# EAGLE design 2te8x24V_DC_In_4_v03 (EAGLE 9.6.2)
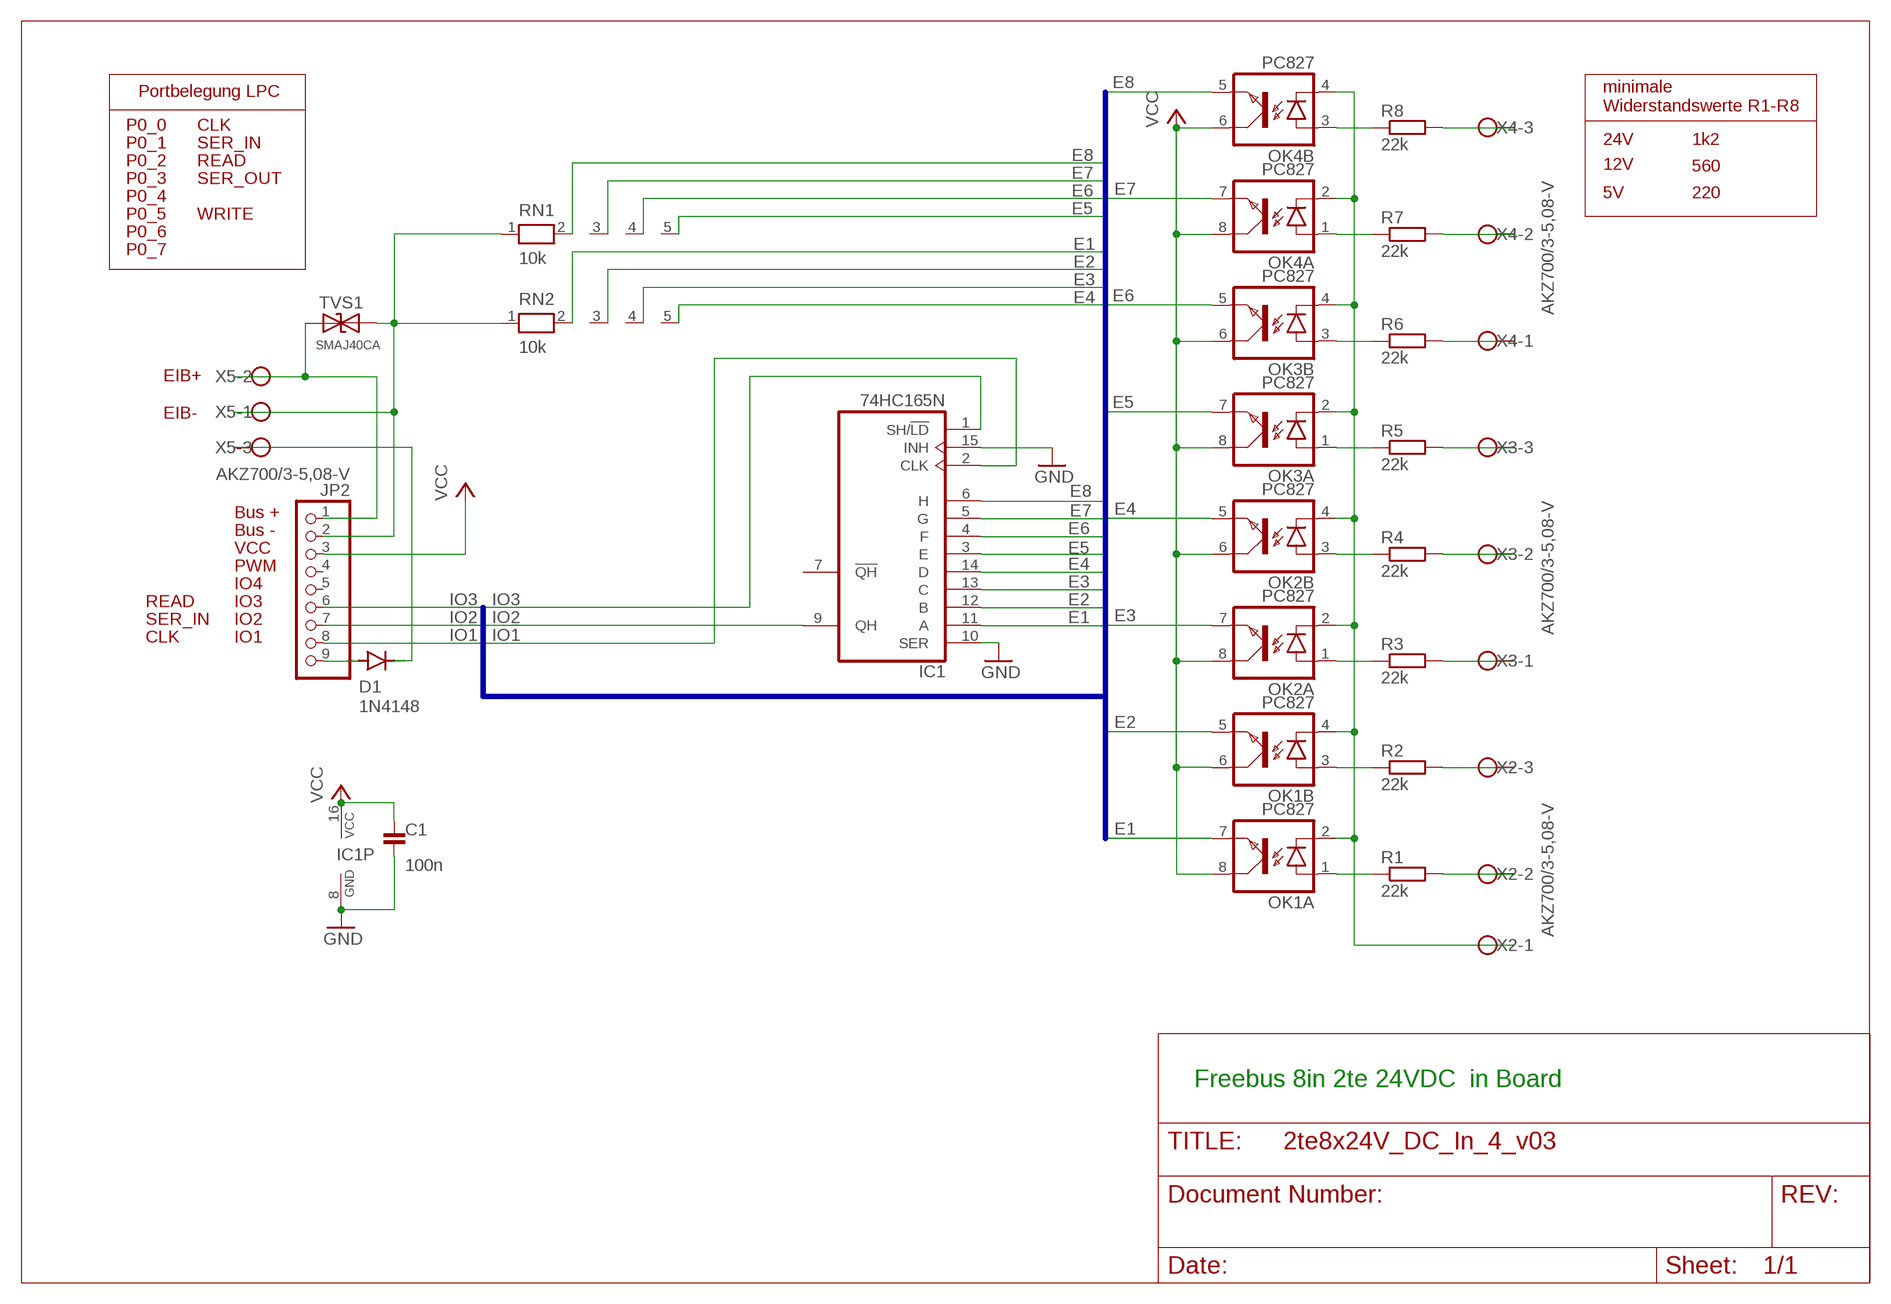
[diagram p0: schematic, sheet 1]

## Parts
C1  100n  C-EU025-024X044  [C025-024X044]
D1  1N4148  1N4148DO35-7  [DO35-7]
IC1  74HC165N  [DIL16]
JP2  PINHD-1X9  [1X09]
OK1  PC827  [DIL08]
OK2  PC827  [DIL08]
OK3  PC827  [DIL08]
OK4  PC827  [DIL08]
R1  22k  R-EU_0207/10  [0207/10]
R2  22k  R-EU_0207/10  [0207/10]
R3  22k  R-EU_0207/10  [0207/10]
R4  22k  R-EU_0207/10  [0207/10]
R5  22k  R-EU_0207/10  [0207/10]
R6  22k  R-EU_0207/10  [0207/10]
R7  22k  R-EU_0207/10  [0207/10]
R8  22k  R-EU_0207/10  [0207/10]
RN1  10k  RN04  [RN-5]
RN2  10k  RN04  [RN-5]
TVS1  SMAJ40CA  [DO-214AC(SMA)_BI]
X2  AKZ700/3-5,08-V  [AKZ700/3-5,08-V]
X3  AKZ700/3-5,08-V  [AKZ700/3-5,08-V]
X4  AKZ700/3-5,08-V  [AKZ700/3-5,08-V]
X5  AKZ700/3-5,08-V  [AKZ700/3-5,08-V]

## Nets
E1: IC1.11(A) OK1.7(A:EMIT) RN2.2
E2: IC1.12(B) OK1.5(B:EMIT) RN2.3
E3: IC1.13(C) OK2.7(A:EMIT) RN2.4
E4: IC1.14(D) OK2.5(B:EMIT) RN2.5
E5: IC1.3(E) OK3.7(A:EMIT) RN1.5
E6: IC1.4(F) OK3.5(B:EMIT) RN1.4
E7: IC1.5(G) OK4.7(A:EMIT) RN1.3
E8: IC1.6(H) OK4.5(B:EMIT) RN1.2
EIB+: JP2.1 TVS1.2(A2) X5.2
GND: C1.2 IC1.8(GND) IC1.10(SER) IC1.15(INH) JP2.2 RN1.1 RN2.1 TVS1.1(A1) X5.1
GND24: OK1.2(A:C) OK1.4(B:C) OK2.2(A:C) OK2.4(B:C) OK3.2(A:C) OK3.4(B:C) OK4.2(A:C) OK4.4(B:C) X2.1
IO1: IC1.2(CLK) JP2.8
IO2: IC1.9(QH) JP2.7
IO3: IC1.1(SH/!LD) JP2.6
N$1: D1.C X5.3
N$2: OK1.1(A:A) R1.1
N$3: R1.2 X2.2
N$4: OK1.3(B:A) R2.1
N$5: R2.2 X2.3
N$6: OK2.1(A:A) R3.1
N$7: R3.2 X3.1
N$8: OK2.3(B:A) R4.1
N$9: R4.2 X3.2
N$10: OK3.1(A:A) R5.1
N$11: R5.2 X3.3
N$12: OK3.3(B:A) R6.1
N$13: R6.2 X4.1
N$14: OK4.1(A:A) R7.1
N$15: R7.2 X4.2
N$16: OK4.3(B:A) R8.1
N$17: R8.2 X4.3
N$18: D1.A JP2.9
VCC: C1.1 IC1.16(VCC) JP2.3 OK1.6(B:COL) OK1.8(A:COL) OK2.6(B:COL) OK2.8(A:COL) OK3.6(B:COL) OK3.8(A:COL) OK4.6(B:COL) OK4.8(A:COL)
Unconnected: IC1.7(!QH) JP2.4 JP2.5

## Buses
IO[1..8],E[1..8]

## Notes on the sheet
- Portbelegung LPC
- minimale
  Widerstandswerte R1-R8
- P0_0 | CLK
- P0_1 | SER_IN | 24V | 1k2
- P0_2 | READ | 12V
- 560
- P0_3 | SER_OUT
- P0_4 | 5V | 220
- P0_5 | WRITE
- P0_6
- P0_7
- EIB+
- EIB-
- Bus +
- Bus -
- VCC
- PWM
- IO4
- READ | IO3
- SER_IN | IO2
- CLK | IO1
- Freebus 8in 2te 24VDC  in Board

## Library data of the parts
C1 = MyRCL:C-EU: CAPACITOR, European symbol; SPICEPREFIX: C
D1 = diode:1N4148: DIODE high speed (Philips)
IC1 = 74xx-eu:74*165: 8-bit parallel load SHIFT REGISTER
JP2 = pinhead:PINHD-1X9: PIN HEADER
OK1-OK4 = optocoupler:PC827: SHARP OPTO COUPLER; OC_FARNELL: unknown; OC_NEWARK: unknown
R1-R8 = MyResistor:R-EU_: RESISTOR, European symbol
RN1 RN2 = resistor-net:RN04: RESISTOR NETWORK; OC_FARNELL: unknown; OC_NEWARK: unknown
TVS1 = MyDiode:SMAJ*CA: Transient Voltage Suppressor Diode https://www.vishay.com/docs/88390/smaj50a.pdf; MARKING: YR; WURTH_ELEKTRONICS: 824501401
X2-X5 = MyCon-PTR-AKZ700:AKZ700/3-5,08-V: PTR AKZ700/3-5,08-V Printklemme Nennstrom: 24 A Nennspannung: 250 V Rastermaß: 5,08 mm Polzahl: 2 Anschlussart: Schraubanschluss Montage: Löten Anschlussrichtung Leiter/Platine: 0 °

## Board
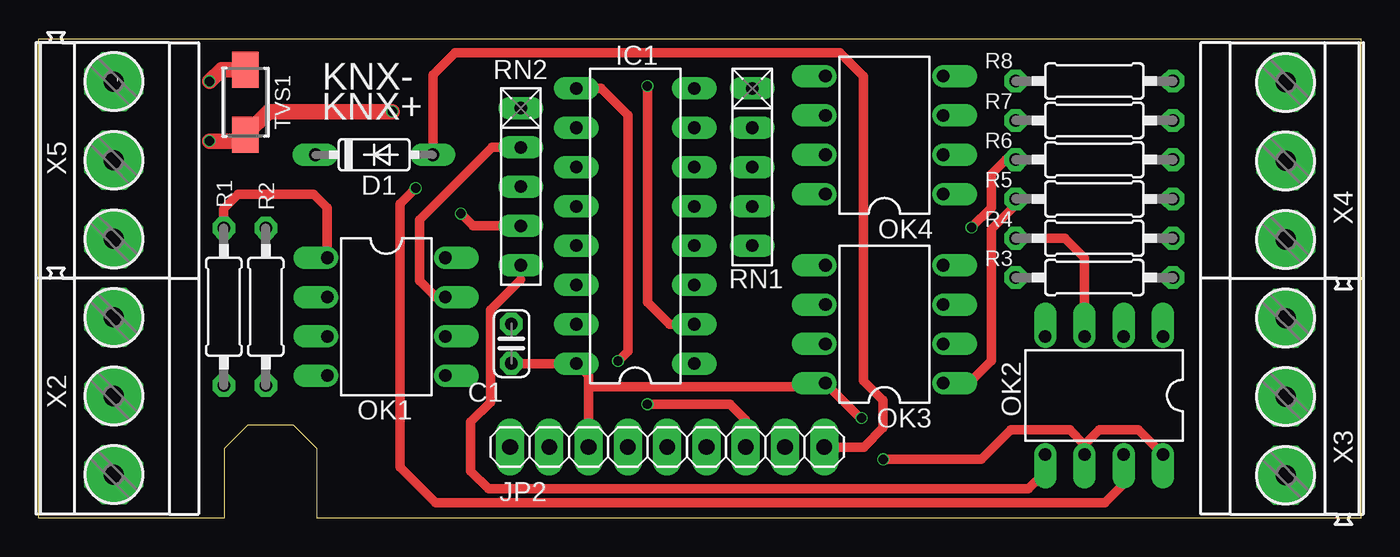
[diagram p1: board, top side]
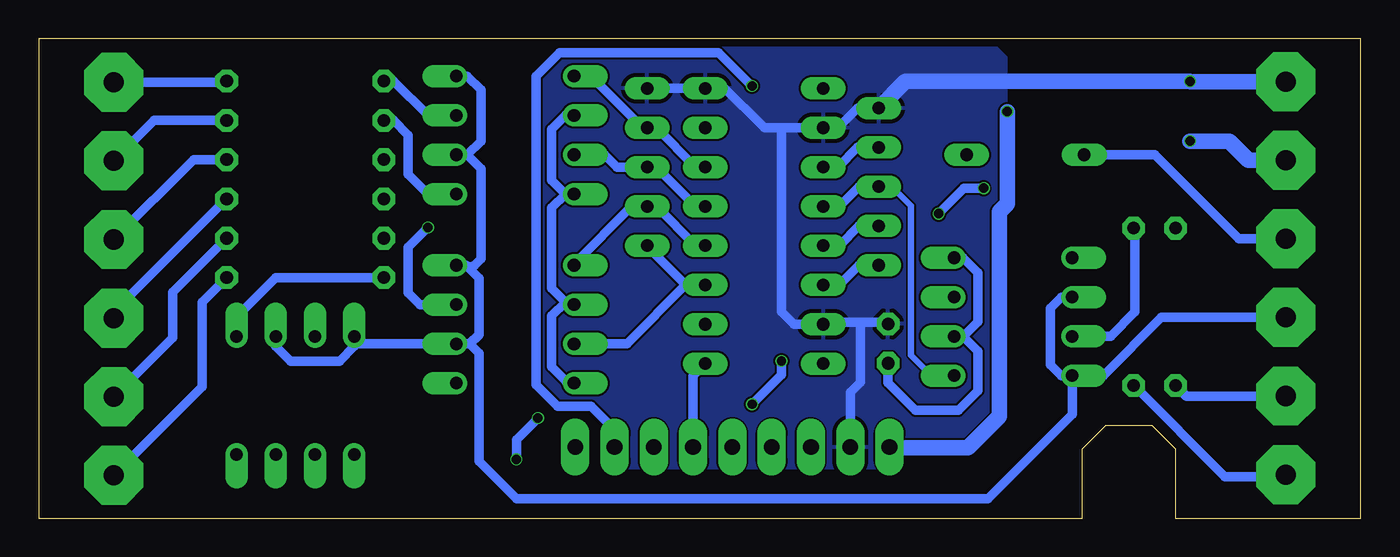
[diagram p2: board, bottom side, seen from below]

Size 85.5 x 31 mm. Coordinates in mm from the lower left corner, seen from the top.
Outline: 0,0 0,31 85.5,31 85.5,0 18,0 18,4.5 16.5,6 13.5,6 12,4.5 12,0 0,0
Copper layers (1*16): Top 0.035mm / dielectric 1.6mm / Bottom 0.035mm
Design rules "jlcpcb-2layers": minimum track width 5mil, minimum drill 0.3mm, track to track 5mil, track to pad 5mil, pad to pad 5mil, via to via 5mil, smd to smd 5mil, copper to edge 0.2mm, drill to drill 6mil, minimum pad ring 10mil, minimum via ring 3mil, stop-mask expansion 4mil, vias tented up to drill 0mil, thermal gap 10mil

### Footprints (pad centres in the part's own frame; a part is rotated, then mirrored left to right if it is on the bottom)
C025-024X044 = drill 0.813 octagon: 1 -1.27,0; 2 1.27,0
DO35-7 = drill 0.813 long: A 3.81,0; C -3.81,0
DIL16 = drill 0.813 long: 1 -8.89,-3.81; 2 -6.35,-3.81; 3 -3.81,-3.81; 4 -1.27,-3.81; 5 1.27,-3.81; 6 3.81,-3.81; 7 6.35,-3.81; 8 8.89,-3.81; 9 8.89,3.81; 10 6.35,3.81; 11 3.81,3.81; 12 1.27,3.81; 13 -1.27,3.81; 14 -3.81,3.81; 15 -6.35,3.81; 16 -8.89,3.81
1X09 = drill 1.016 long: 1 -10.16,0; 2 -7.62,0; 3 -5.08,0; 4 -2.54,0; 5 0,0; 6 2.54,0; 7 5.08,0; 8 7.62,0; 9 10.16,0
DIL08 = drill 0.813 offset: 1 -3.81,-3.81; 2 -1.27,-3.81; 3 1.27,-3.81; 4 3.81,-3.81; 5 3.81,3.81; 6 1.27,3.81; 7 -1.27,3.81; 8 -3.81,3.81
0207/10 = drill 0.813 octagon: 1 -5.08,0; 2 5.08,0
RN-5 = drill 0.813 long: 1 -5.08,0; 2 -2.54,0; 3 0,0; 4 2.54,0; 5 5.08,0
DO-214AC(SMA)_BI = smd 2.3 x 1.7: 1 -2.1,0; 2 2.1,0
AKZ700/3-5,08-V = drill 1.3 pad 3.81 octagon: 1 -7.641,0.025; 2 -2.561,0.025; 3 2.519,0.025

### Placement (x,y rotation side)
C1  30.58,11.29 90 top
D1  21.69,23.5 0 top
IC1  38.58,18.89 90 top
JP2  40.64,4.6 0 top
OK1  22.48,13.03 270 top
OK2  68.9,7.94 180 top
OK3  54.69,12.54 90 top
OK4  54.69,24.76 90 top
R1  11.97,13.67 270 top
R2  14.68,13.67 270 top
R3  68.26,15.56 0 top
R4  68.26,18.1 0 top
R5  68.26,20.64 0 top
R6  68.26,23.18 0 top
R7  68.26,25.72 0 top
R8  68.26,28.26 0 top
RN1  46.15,22.7 270 top
RN2  31.18,21.43 270 top
TVS1  13.37,26.89 270 top
X2  4.83,5.34 270 top
X3  80.66,10.42 90 top
X4  80.66,25.66 90 top
X5  4.83,20.58 270 top

### Tracks (layer width: path | path; a pad name or v marks a point on that pad's centre or on a via)
E1
  Top 0.61: OK1.7 25.7,14.3 24.64,15.37 24.64,19.3 29.3,23.97 RN2.2
  Bottom 0.61: RN2.2 32.54,23.97 33.81,22.7 IC1.11
E2
  Bottom 0.406: RN2.3 30.32,21.43 29.08,20.19 29.08,10.54 27.76,9.22 OK1.5
  Bottom 0.61: IC1.12 33.72,20.16 32.45,21.43 RN2.3
E3  (via drill 0.61)
  Top 0.61: RN2.4 28.1,18.89 v27.3,19.68 | v24.38,21.34 23.37,20.32 23.37,3.3 25.65,1.02 68.96,1.02 70.17,2.22 OK2.7
  Bottom 0.61: IC1.13 33.72,17.62 32.45,18.89 RN2.4 | v27.3,19.68 25.65,21.34 v24.38,21.34
E4
  Top 0.406: RN2.5 31.18,15.43 | 65.09,2.98 OK2.5
  Top 0.61: 31.18,15.43 29.21,13.46 29.21,7.49 27.94,6.22 27.94,3.05 29.08,1.91 64.01,1.91 65.09,2.98
  Bottom 0.61: IC1.14 33.72,15.08 32.45,16.35 RN2.5
E5
  Bottom 0.406: 46.15,17.57 RN1.5
  Bottom 0.61: IC1.3 43.66,15.08 | 43.66,15.08 46.15,17.57 | OK3.7 47.47,11.27 43.66,15.08
E6
  Bottom 0.61: IC1.4 43.02,17.62 45.56,20.16 RN1.4 47.15,20.16 50.88,16.43 OK3.5
E7
  Bottom 0.406: OK4.7
  Bottom 0.61: IC1.5 43.02,20.16 45.56,22.7 RN1.3 48.1,22.7 48.9,23.5 OK4.7
E8
  Bottom 0.406: RN1.2 46.31,25.4 46.61,25.4
  Bottom 0.61: IC1.6 43.02,22.7 45.56,25.24 RN1.2 | 46.61,25.4 49.78,28.57 OK4.5
EIB+  (via drill 0.61)
  Top 1.016: v11.05,24.38 12.96,24.38 TVS1.2 14.87,26.29 v22.86,26.29
  Bottom 0.61: 30.45,4.57 JP2.1
  Bottom 1.016: X5.2 7.27,23.14 8.52,24.38 v11.05,24.38 | v22.86,26.29 22.86,20.32 23.37,19.81 23.37,6.6 25.4,4.57 30.45,4.57
GND  (via drill 0.61)
  Top 1.016: v11.05,28.25 11.84,28.99 TVS1.1
  Bottom 0.406: 11.02,28.22 11.05,28.19 v11.05,28.25 | 34.62,12.68 IC1.15 | 37.31,25.24 37.47,25.08 | 42.23,27.94 IC1.8 | RN1.1
  Bottom 0.61: 32.35,12.68 32.35,8.79 33.02,8.13 JP2.2 | C1.2 30.7,12.68 32.35,12.68 | 34.62,12.68 32.35,12.68 | RN2.1 32.54,26.51 33.81,25.24 IC1.10 37.31,25.24 38.58,25.24 41.27,27.94 42.23,27.94 | IC1.15 36.67,12.54 37.47,13.34 37.47,25.08 | IC1.8 RN1.1
  Bottom 1.016: X5.1 11.02,28.22 | v11.05,28.25 29.45,28.25 RN2.1
  pour Bottom: 22.86,29.84 23.5,30.48 52.7,30.48 53.34,29.84 53.34,3.81 52.7,3.17 26.04,3.17 22.86,6.35
GND24
  Bottom 0.406: 19.38,9.22 OK1.4 | 65.09,11.43 65.09,11.11 | 57.31,16.35 OK3.4
  Bottom 0.61: X2.1 12.89,12.98 16.64,9.22 OK1.4 18.67,6.73 24.13,1.27 54.61,1.27 57.02,3.68 57.02,10.67 57.63,11.27 | 57.63,11.27 OK3.2 64.93,11.27 65.09,11.43 OK2.4 | OK1.2 19.36,14.3 20.07,13.59 20.07,9.91 19.38,9.22 | 65.09,11.11 66.04,10.16 69.22,10.16 70.17,11.11 OK2.2 | OK4.4 57.78,28.57 56.9,27.69 56.9,24.38 57.78,23.5 | OK4.2 57.78,23.5 | 57.78,23.5 56.9,22.61 56.9,16.76 57.31,16.35 | OK3.4 57.86,16.35 57.02,15.51 57.02,11.88 57.63,11.27
IO1  (via drill 0.61)
  Top 0.61: v39.37,27.94 39.37,13.97 40.8,12.54 IC1.2
  Bottom 0.61: JP2.8 48.26,5.71 49.78,7.24 51.94,7.24 53.34,8.64 53.34,28.57 51.82,30.1 41.53,30.1 v39.37,27.94
IO2  (via drill 0.61)
  Top 0.61: JP2.7 45.72,6.35 44.7,7.37 v39.37,7.37 | v37.47,10.16 38.1,10.79 38.1,26.04 36.35,27.78 IC1.9
  Bottom 0.61: v39.37,7.37 37.47,9.27 v37.47,10.16
IO3
  Bottom 0.61: IC1.1 43.18,9.21 JP2.6
N$1
  Bottom 0.61: X5.3 7.9,18.06 13.34,23.5 D1.C
N$2
  Top 0.61: R1.1 11.97,20.02 12.91,20.95 17.78,20.95 18.67,20.07 OK1.1
N$3
  Bottom 0.61: R1.2 11.28,7.9 X2.2
N$4
  Bottom 0.406: 14.61,18.67 R2.1
  Bottom 0.61: OK1.3 16.18,11.76 14.61,13.34 14.61,18.67
N$5
  Bottom 0.406: X2.3 4.99,2.69 | R2.2
  Bottom 0.61: 4.99,2.69 8.79,2.69 R2.2
N$6
  Bottom 0.61: R3.1 70.17,15.56 72.71,13.02 OK2.1
N$7
  Bottom 0.61: R3.2 74.93,13.97 74.93,8.49 X3.1
N$8
  Top 0.61: R4.1 66.36,18.1 67.63,16.83 OK2.3
N$9
  Bottom 0.61: R4.2 76.83,14.61 76.83,11.66 X3.2
N$10
  Top 0.406: 63.18,20.26 R5.1
  Top 0.61: OK3.1 60.17,8.73 61.61,10.18 61.61,18.69 63.18,20.26
N$11
  Bottom 0.406: X3.3 | R5.2
  Bottom 0.61: X3.3 80.64,13.34 R5.2
N$12  (via drill 0.61)
  Top 0.61: v60.33,18.8 61.59,20.07 61.59,22.23 62.55,23.18 R6.1
  Bottom 0.61: OK3.3 60.83,13.81 61.59,14.57 61.59,17.53 v60.33,18.8
N$13
  Bottom 0.61: X4.1 75.48,23.18 R6.2
N$14
  Bottom 0.61: OK4.1 60.33,20.95 61.59,22.23 61.59,24.77 62.55,25.72 R7.1
N$15
  Bottom 0.61: X4.2 78.02,25.72 R7.2
N$16
  Bottom 0.61: OK4.3 60.33,26.04 62.55,28.26 R8.1
N$17
  Bottom 0.406: 73.42,28.18 R8.2
  Bottom 0.61: X4.3 73.42,28.18
N$18
  Top 0.61: JP2.9 53.37,4.6 54.61,5.84 54.61,7.62 53.34,8.89 53.34,28.57 51.82,30.1 26.92,30.1 25.5,28.68 D1.A
VCC  (via drill 0.61)
  Top 0.406: OK3.8 49.86,8.73 49.86,8.51 | 53.13,6.48 v53.21,6.48 | OK2.8
  Top 0.61: C1.1 30.59,10 IC1.16 35.56,9.21 35.56,8.51 | 35.56,8.51 JP2.3 | 49.86,8.51 35.56,8.51 | OK3.8 53.13,6.48 | v54.61,3.81 60.96,3.81 62.87,5.71 66.67,5.71 67.63,4.76 | OK2.6 67.63,4.76 | 67.63,4.76 68.58,5.71 71.12,5.71 OK2.8
  Bottom 0.406: 25.7,11.76 OK1.6 | 51.04,8.89 51.44,8.89 | 51.44,13.97 51.04,13.97 OK3.6 | 51.44,20.95 OK4.8 | OK4.8 | 51.44,26.04 OK4.6 | OK4.6
  Bottom 0.61: OK1.8 25.73,16.84 24.77,15.88 24.77,12.7 25.7,11.76 | OK1.6 25.73,11.76 24.77,10.79 24.77,8.26 26.04,6.99 28.81,6.99 30.57,8.75 C1.1 | OK3.8 51.04,8.89 | 51.44,8.89 52.32,9.78 52.32,13.08 51.44,13.97 52.32,14.86 52.32,20.07 51.44,20.95 52.32,21.84 52.32,25.15 51.44,26.04 | v53.21,6.48 54.61,5.08 v54.61,3.81

### Text on the board
tPlace: KNX- | KNX+